# Altium schematic sheet QCopterFly_EXTERN_Sch.SchDoc
size A4
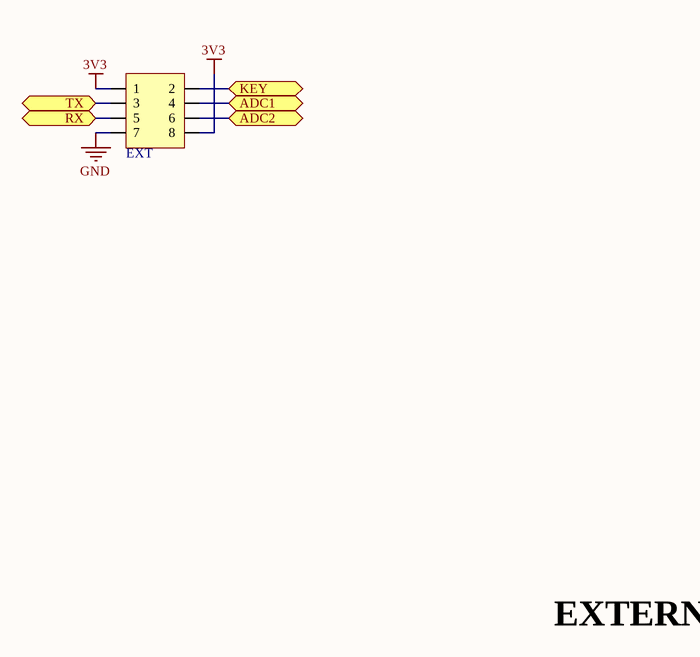
[diagram p0: QCopterFly_EXTERN_Sch.SchDoc]

## Parts
EXT  HDR2X4_90_2.54  [HDR2X4_90_2.54]  (value not drawn)

## Ports
ADC1, ADC2, KEY, RX, TX

## Nets
3V3: EXT.1 EXT.8
GND: EXT.7
ADC1: EXT.4 ; port ADC1
ADC2: EXT.6 ; port ADC2
KEY: EXT.2 ; port KEY
RX: EXT.5 ; port RX
TX: EXT.3 ; port TX

## Notes on the sheet
- Labels drawn without touching a wire or pin: EXTERN

## Library data of the parts
EXT = HDR2X4_90_2.54: Header